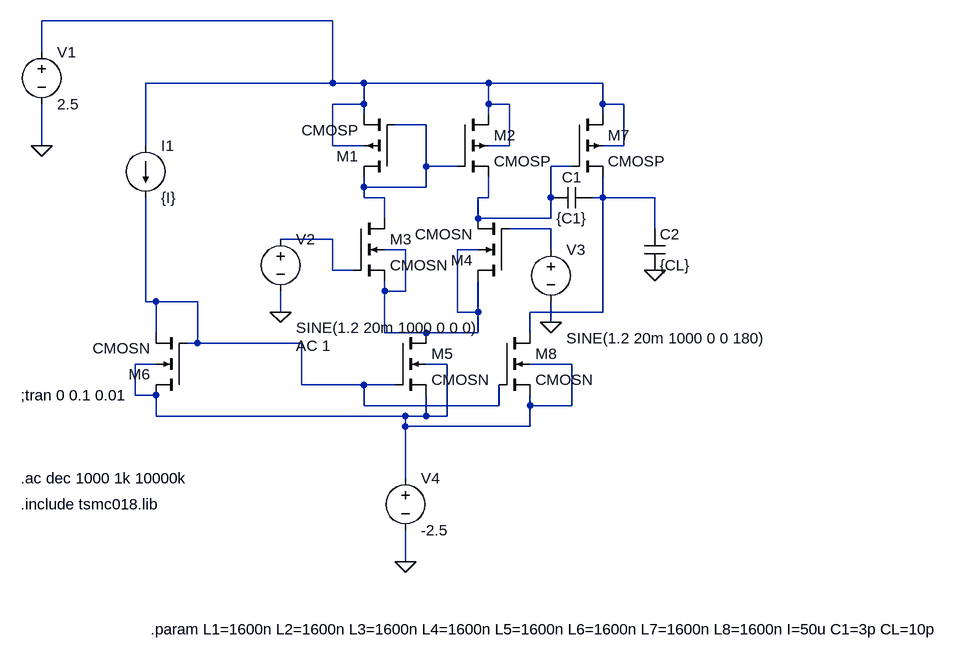
[diagram p0: schematic opamp2.asc]
opamp2.asc, the LTspice schematic file:
Version 4
SHEET 1 1208 696
WIRE 128 -256 -320 -256
WIRE -320 -208 -320 -256
WIRE 128 -160 128 -256
WIRE 128 -160 -160 -160
WIRE 176 -160 128 -160
WIRE 368 -160 176 -160
WIRE 544 -160 368 -160
WIRE 176 -128 176 -160
WIRE 176 -128 128 -128
WIRE 368 -128 368 -160
WIRE 400 -128 368 -128
WIRE 544 -128 544 -160
WIRE 576 -128 544 -128
WIRE 176 -112 176 -128
WIRE 368 -112 368 -128
WIRE 544 -112 544 -128
WIRE 272 -96 224 -96
WIRE -320 -64 -320 -128
WIRE -160 -64 -160 -160
WIRE 128 -64 128 -128
WIRE 176 -64 128 -64
WIRE 400 -64 400 -128
WIRE 400 -64 368 -64
WIRE 576 -64 576 -128
WIRE 576 -64 544 -64
WIRE 272 -32 272 -96
WIRE 320 -32 272 -32
WIRE 496 -32 464 -32
WIRE 176 0 176 -16
WIRE 272 0 272 -32
WIRE 272 0 176 0
WIRE 176 16 176 0
WIRE 208 16 176 16
WIRE 368 16 368 -16
WIRE 368 16 352 16
WIRE 464 16 464 -32
WIRE 544 16 544 -16
WIRE 544 16 528 16
WIRE 624 16 544 16
WIRE 208 48 208 16
WIRE 352 48 352 16
WIRE 464 48 464 16
WIRE 464 48 352 48
WIRE 464 64 400 64
WIRE 624 64 624 16
WIRE 128 80 48 80
WIRE 240 96 208 96
WIRE 352 96 320 96
WIRE 464 96 464 64
WIRE 128 128 128 80
WIRE 160 128 128 128
WIRE 208 160 208 144
WIRE 240 160 240 96
WIRE 240 160 208 160
WIRE -160 176 -160 16
WIRE -144 176 -160 176
WIRE -80 176 -144 176
WIRE 48 192 48 160
WIRE 320 192 320 96
WIRE 352 192 352 144
WIRE 352 192 320 192
WIRE 544 192 544 16
WIRE 544 192 432 192
WIRE 464 208 464 176
WIRE -144 224 -144 176
WIRE 208 224 208 160
WIRE 272 224 208 224
WIRE 352 224 352 192
WIRE 352 224 272 224
WIRE 432 224 432 192
WIRE -80 240 -80 176
WIRE -80 240 -96 240
WIRE 80 240 -80 240
WIRE -144 272 -176 272
WIRE 304 272 272 272
WIRE 496 272 432 272
WIRE 80 304 80 240
WIRE 176 304 80 304
WIRE 224 304 176 304
WIRE -176 320 -176 272
WIRE -144 320 -176 320
WIRE 176 336 176 304
WIRE 384 336 384 304
WIRE 384 336 176 336
WIRE 432 336 432 320
WIRE 496 336 496 272
WIRE 496 336 432 336
WIRE -144 352 -144 320
WIRE 240 352 -144 352
WIRE 272 352 272 320
WIRE 272 352 240 352
WIRE 304 352 304 272
WIRE 304 352 272 352
WIRE 240 368 240 352
WIRE 432 368 432 336
WIRE 432 368 240 368
WIRE 240 448 240 368
WIRE 240 576 240 528
FLAG -320 -64 0
FLAG 240 576 0
FLAG 48 192 0
FLAG 464 208 0
FLAG 624 128 0
SYMBOL cmosp 224 -16 R180
SYMATTR InstName M1
SYMATTR Value2 l=180n w={L1}
SYMBOL cmosp 320 -112 R0
SYMATTR InstName M2
SYMATTR Value2 l=180n w={L2}
SYMBOL cmosn 160 48 R0
SYMATTR InstName M3
SYMATTR Value2 l=180n w={L3}
SYMBOL cmosn 400 144 R180
SYMATTR InstName M4
SYMATTR Value2 l=180n w={L4}
SYMBOL cmosn 224 224 R0
SYMATTR InstName M5
SYMATTR Value2 l=180n w={L5}
SYMBOL cmosn -96 320 R180
SYMATTR InstName M6
SYMATTR Value2 l=180n w={L6}
SYMBOL current -160 -64 R0
WINDOW 123 0 0 Left 0
WINDOW 39 0 0 Left 0
SYMATTR InstName I1
SYMATTR Value {I}
SYMBOL voltage -320 -224 R0
WINDOW 123 0 0 Left 0
WINDOW 39 0 0 Left 0
SYMATTR InstName V1
SYMATTR Value 2.5
SYMBOL voltage 48 64 R0
WINDOW 3 24 152 Left 2
WINDOW 123 24 180 Left 2
WINDOW 39 0 0 Left 0
SYMATTR Value SINE(1.2 20m 1000 0 0 0)
SYMATTR Value2 AC 1
SYMATTR InstName V2
SYMBOL voltage 464 80 R0
WINDOW 3 24 152 Left 2
WINDOW 123 24 180 Left 2
WINDOW 39 0 0 Left 0
SYMATTR Value SINE(1.2 20m 1000 0 0 180)
SYMATTR InstName V3
SYMBOL voltage 240 432 R0
WINDOW 123 0 0 Left 0
WINDOW 39 0 0 Left 0
SYMATTR InstName V4
SYMATTR Value -2.5
SYMBOL cmosp 496 -112 R0
SYMATTR InstName M7
SYMATTR Value2 l=180n w={L7}
SYMBOL cap 528 0 R90
WINDOW 0 0 32 VBottom 2
WINDOW 3 32 32 VTop 2
SYMATTR InstName C1
SYMATTR Value {C1}
SYMBOL cap 608 64 R0
SYMATTR InstName C2
SYMATTR Value {CL}
SYMBOL cmosn 384 224 R0
SYMATTR InstName M8
SYMATTR Value2 l=180n w={L8}
TEXT -352 448 Left 2 !.ac dec 1000 1k 10000k
TEXT -352 488 Left 2 !.include tsmc018.lib
TEXT -352 320 Left 2 !;tran 0 0.1 0.01
TEXT -152 680 Left 2 !.param L1=1600n L2=1600n L3=1600n L4=1600n L5=1600n L6=1600n L7=1600n L8=1600n I=50u C1=3p CL=10p

The netlist it stands for:
* opamp2.asc
M1 N002 N002 N001 N001 CMOSP l=180n w={L1}
M2 N001 N002 N003 N001 CMOSP l=180n w={L2}
M3 N002 N006 N007 N007 CMOSN l=180n w={L3}
M4 N007 N005 N003 N007 CMOSN l=180n w={L4}
M5 N007 N008 N009 N009 CMOSN l=180n w={L5}
M6 N009 N008 N008 N009 CMOSN l=180n w={L6}
I1 N001 N008 {I}
V1 N001 0 2.5
V2 N006 0 SINE(1.2 20m 1000 0 0 0) AC 1
V3 N005 0 SINE(1.2 20m 1000 0 0 180)
V4 N009 0 -2.5
M7 N001 N003 N004 N001 CMOSP l=180n w={L7}
C1 N004 N003 {C1}
C2 N004 0 {CL}
M8 N004 N008 N009 N009 CMOSN l=180n w={L8}
.model NMOS NMOS
.model PMOS PMOS
.lib standard.mos
.ac dec 1000 1k 10000k
.include tsmc018.lib
;tran 0 0.1 0.01
.param L1=1600n L2=1600n L3=1600n L4=1600n L5=1600n L6=1600n L7=1600n L8=1600n I=50u C1=3p CL=10p
.backanno
.end